# Altium schematic sheet Power.SchDoc: Power Conversions
size 279 x 215 mm; Engineer: Ari Wasch; Organization: UW Robotics; Address1: 200 University Avenue; Address2: Waterloo; Address3: Ontario; Address4: Canada N2L 3G6; DocumentNumber: 1; Revision: 1; SheetNumber: 1; SheetTotal: 3
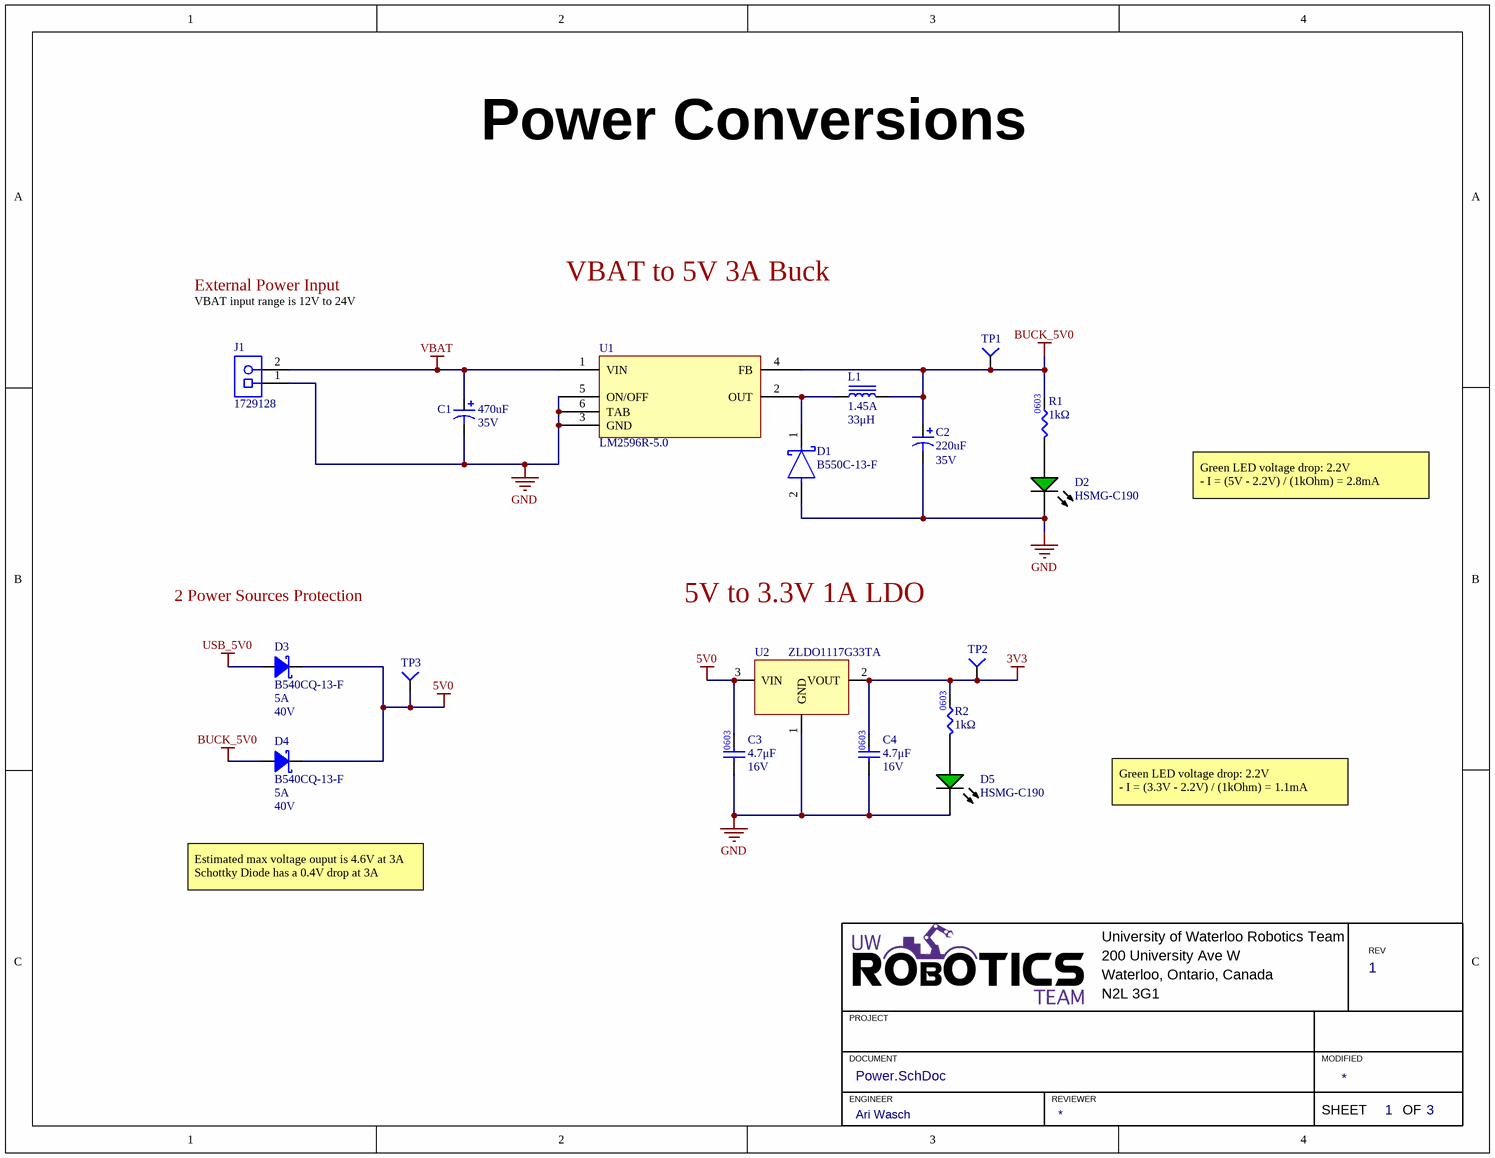
[diagram p0: Power.SchDoc]

## Parts
C1  Voltage: 35V  Capacitance: 470uF  [CAPAE1030X1100N]  (hidden comment: CAP_470uF_35V_ALUM)
C2  220uF  Voltage: 35V  [CAP_8x10.2]
C3  value 4.7μF  Voltage Rating: 16V  [CAP0603]  (hidden comment: CAP_4.7uF_35V_0603)
C4  value 4.7μF  Voltage Rating: 16V  [CAP0603]  (hidden comment: CAP_4.7uF_35V_0603)
D1  B550C-13-F  [FP-SMC-MFG]
D2  HSMG-C190  [AVAG-HSMX-C190_V]
D3  Manufacturer Part Number 1: B540CQ-13-F  Forward Current: 5A  Voltage: 40V  [DO214AB SMC]  (hidden comment: DIO_SCHOTTKY_40V_5A)
D4  Manufacturer Part Number 1: B540CQ-13-F  Forward Current: 5A  Voltage: 40V  [DO214AB SMC]  (hidden comment: DIO_SCHOTTKY_40V_5A)
D5  HSMG-C190  [AVAG-HSMX-C190_V]
J1  1729128  [PHOE-1729128-2_V]
L1  DC Current: 1.45A  Inductance: 33μH  [IND_CKCS6045]  (hidden comment: IND_33uH_1.45A)
R1  value 1kΩ  [RES0603]  (hidden comment: RES_1kΩ_0603_5%)
R2  value 1kΩ  [RES0603]  (hidden comment: RES_1kΩ_0603_5%)
TP1  TESTPOINT_1MM_SQUARE  [TESTPOINT_SQUARE_1MM]  (value not drawn)  (no BOM)
TP2  TESTPOINT_1MM_SQUARE  [TESTPOINT_SQUARE_1MM]  (value not drawn)  (no BOM)
TP3  TESTPOINT_1MM_SQUARE  [TESTPOINT_SQUARE_1MM]  (value not drawn)  (no BOM)
U1  LM2596R-5.0  [LM2596S-5.0]
U2  LDO_3.3V_1A  [ZLDO1117G33TA]  (value not drawn)

## Nets
3V3: C4.2 R2.2 TP2.1(=value) U2.2(VOUT)
5V0: C3.2 D3.2(Cathode) D4.2(Cathode) TP3.1(=value) U2.3(VIN)
BUCK_5V0: C2.1 D4.1(Anode) L1.2 R1.2 TP1.1(=value) U1.4(FB)
GND: C1.2 C2.2 C3.1 C4.1 D1.2(A) D2.2(K) D5.2(K) J1.1 U1.3(GND) U1.5(ON/OFF) U1.6(TAB) U2.1(GND)
USB_5V0: D3.1(Anode)
VBAT: C1.1 J1.2 U1.1(VIN)
NetD1_1: D1.1(C) L1.1 U1.2(OUT)
NetD2_1: D2.1(A) R1.1
NetD5_1: D5.1(A) R2.1

## Notes on the sheet
- External Power Input
- VBAT to 5V 3A Buck
- VBAT input range is 12V to 24V
- Green LED voltage drop: 2.2V
  - I = (5V - 2.2V) / (1kOhm) = 2.8mA
- 2 Power Sources Protection
- 5V to 3.3V 1A LDO
- Green LED voltage drop: 2.2V
  - I = (3.3V - 2.2V) / (1kOhm) = 1.1mA
- Estimated max voltage ouput is 4.6V at 3A
  Schottky Diode has a 0.4V drop at 3A
- University of Waterloo Robotics Team
- 200 University Ave W
- REV
- PROJECT
- Waterloo, Ontario, Canada
- N2L 3G1
- DOCUMENT
- ENGINEER
- REVIEWER
- MODIFIED
- SHEET
- OF

## Library data of the parts
C1 = CAP_470uF_35V_ALUM: CAP ALUM 470uF 20% 35V SMD; Manufacturer 1: ROQANG; Manufacturer Part Number 1: RVT1V471M1010; Datasheet Link: https://datasheet.lcsc.com/szlcsc/2004031004_ROQANG-RVT1V471M1010_C72519.pdf; Height: 11mm; LCSC Number: C72519
C2 = CAP_220uF_35V_ALUM: 220uF 35V Cap; Manufacturer Part Number: VT1V221M0810; Manufacturer 1: KNSCHA; Package: 8x10.2mm; LCSC Number: C310848; Capacitance: 220 uF; Supplier 1: LCSC
C3 C4 = CAP_4.7uF_35V_0603: CAP CER 4.7UF 16V X6S 0603; Manufacturer Part Number 1: CL10A475KO8NNNC; Manufacturer 1: Samsung Electro-Mechanics; Package/Footprint: 0603; Dielectric: X5R; Supplier 1: LCSC; Mounting Type: SMD; LCSC Number: C19666
D1 = CMP-2000-05906-2: DIODE SCHOTTKY 50V 5A SMC; Peak Reverse Current: 500uA; Peak Non-Repetitive Surge Current: 100A; Capacitance: 300pF; Forward Voltage: 700mV; Polarity: Standard; Element Configuration: Single; Length: 7.11mm; Max Operating Temperature: 125°C; Lead Free: Lead Free; Packaging: Tape and Reel; Current Rating: 5A; Output Current: 5A; Termination: SMD/SMT; Mount: Surface Mount; Radiation Hardening: No; Width: 6.22mm; Min Operating Temperature: -55°C; Forward Current: 5A; Voltage Rating (DC): 50V; Case/Package: SMC; Average Rectified Current: 5A; Max Forward Surge Current (Ifsm): 100A; Package Quantity: 3000; REACH SVHC: No SVHC; Max Reverse Voltage (DC): 50V; Number of Pins: 2; Max Repetitive Reverse Voltage (Vrrm): 50V; Height: 2.5mm; Contact Plating: Tin; Weight: 0.007408oz; LCSC Number: C134461
D2 D5 = CMP-1744-00002-1: Chip LED, Green, 2.2 V, -40 to 85 degC, 2-Pin SMD, RoHS, Tape and Reel; Frequency: 400 KHz; Max Supply Voltage: 5.5 V; Access Time: 3500 ns; Clock Frequency: 100 KHz; Case\Package: SOIC; Density: 32 kb; Nominal Supply Current: 2 mA; Interface: Serial; Min Supply Voltage: 1.7 V; Packaging: Tape and Reel; PackageReference: HSMX-C190; ComponentLink2URL: http://docs.avagotech.com/docs/AV02-0551EN; RoHSCompliant: true; Pins: 8; REACH SVHC: No SVHC; Max Operating Temperature: 85 degC; Width: 4 mm; Radiation Hardening: No; Package Quantity: 3000; ComponentLink3Description: Package Specification; ComponentLink1Description: Manufacturer URL; Min Operating Temperature: -40 degC; PackageDescription: 2-Pin Surface Mount Device, Body 1.6 x 0.8 mm, Height 0.9 mm; Max Clock Frequency: 100 KHz; Height: 1.5 mm; ComponentLink1URL: http://www.avagotech.com/; DatasheetVersion: Mar-12; ComponentLink2Description: Datasheet; Mount: Surface Mount; Length: 5 mm; ComponentLink3URL: http://www.fairchildsemi.com/dwg/MA/MA03D.pdf; LCSC Number: C188729
D3 D4 = DIO_SCHOTTKY_40V_5A: DIODE SCHOTTKY 40V 5A SMC; Manufacturer 1: Diodes; Peak Reverse Current: 500uA; Peak Non-Repetitive Surge Current: 100A; Forward Voltage: 550mV; Capacitance: 300pF; Supplier 1: Digi-Key; Mounting Type: SMD; Package/Footprint: SMC; Max Repetitive Reverse Voltage (Vrrm): 40V; Max Forward Surge Current (Ifsm): 100A; Voltage Rating (DC): 40V; Current Rating: 5A; Max Reverse Voltage (DC): 40V; Current: 5A; Supplier Part Number 1: B540C-FDIDKR-ND; LCSC Number: C105556
J1 = CMP-2000-05815-1: PCB Terminal Block, 13.5 A, 400 V, 2-Pin THD, RoHS, Bulk; Manufacturer: Phoenix Contact; Package Version: 03/2015; No. of Rows: 1; Pitch: 5.08mm; No. of Positions: 2; Voltage Rating: 400V; Current Rating: 13500mA; Manufacturer URL: http://www.phoenixcontact.com/; Datasheet URL: https://datasheet.ciiva.com/16046/1729128-16046181.pdf; RoHS: TRUE; Package URL: https://www.phoenixcontact.com/online/portal/pi/pxc/product_detail_page/!ut/p/b1/3VdJjqNKFDxLH8AFycySyWY2ozFsEPOMMQaDOX1XedGL_1Vdm5YXJleknhSKeBkvI6EA8ncAo3AYoDhBQGco6KN7VURTdemj9us_IEKEZo_YHiPAEWEFmDGOHMORkqKYCORBZxgL7ZoaZYcbFFUZ3fqxSY6GOuxydWUuHqz1ynmMFygu583Bob0Ewr6Sd_l-5m-kAueHiB0jpRwZwe58wwtkpxtMYd_LmGcDRU02dRNEyWt6Y2ti5pSyJ_reIkzIulrqApdnbT11V5jnCKbYNCvhEM1MCpPByat_X379-iThf08CI5GfOPqfBeS3BRoBOdD55AKVv0iLwCMq-2BrzXWSGRH7pUGD9uwXQjiph3xL0DKQwdGa0JImiIOmBNOestqgwTHSSs2oOep-78apyXQBvNi8ZLaFjvjWvcaUEBu0MC6Wbe-d6mB0FAebo2lUWinqYaZs5DAYzV0RP9yitUjnGJ0iI9xhZkT42OCQNUJJhkgWINNQLP2JFP6OpMg3JCVg70jqHT0lvKOnhHf0lPuOnnLf0VPuWx6_dxwUIvwk5WMkT0kLL1mh61l2yZVSzG3pYV_bqo-mj6uMKwKwdnnW8Jh5RTOJzMOA5c-eJDaZQw4mTMPH02PvS_ZAqNVjVTo2WyYLkwH_KU1mmmG5kjRhDqPXLwwVHvVOjCM60-fpXvTDfMGW1PVFVS1r4e4yVDk4ZdNbkUHvqPqQSeian4UD39fNKmachqdJ1NJbyk8rXT9mXTvPk3oE5meulKGgiruPJek-4I9hTT6G8ZLOyRSm2RRVbThERQad5OS28hdt4YW4vG0stgYYzsWsK4_7y6DZMjJSCqri1kyiZR5vD7pwIrNR7QwPHTcLTI5qT7eRlpHrdGiupYlqQDJ7zy_CND8fWWBoLRXxk1RVcXiBQwbTD4Xi7KL-FuO94t9xaqweXzH; PartNumber: 1729128; Package Description: 2-Pin Through Hole Device, Body 8.1 x 10.16 mm, Pitch 5.08 mm; Datasheet Version: 12/2013; Mounting Technology: ThroughHole; Orientation: Horizontal; Package Reference: 1729128-2; Packing: Bulk; LCSC Number: C91153
L1 = IND_33uH_1.45A: INDUCTOR 33UH 1.45A SMD ROHS; Manufacturer 1: CENKER; Manufacturer Part Number 1: CKCS6045-33uH; DC Resistance (DCR): 137mΩ; RMS Current (Irms): 1.45A; LCSC Number: C354635
R1 R2 = RES_1kΩ_0603_5%: RES 1K OHM 5% 1/10W 0603; Manufacturer 1: Yageo; Manufacturer Part Number 1: RC0603JR-071KL; Package/Footprint: 0603; Supplier Part Number 1: 311-1.0KGRCT-ND; Supplier 1: Digi-Key; Mounting Type: SMD; LCSC Number: C14676
TP1-TP3 = TESTPOINT_1MM_SQUARE: TESTPOINT 1MM SQUARE
U1 = LM2596R-5.0: IC REG BUCK 5V 3A TO220-5; Manufacturer 1: HTC Korea TAEJIN Tech; Min Voltage Input: 4.5V; Max Voltage Input: 40V; Voltage Output: 5V; Current Output: 3A; Manufacturer Part Number 1: LM2596R-5.0; Supplier 1: LCSC; LCSC Number: C77782; Datasheet: https://lcsc.com/search?q=WJ127-5.0-3P
U2 = LDO_3.3V_1A: IC REG LINEAR 3.3V 1A SOT223; Manufacturer 1: Diodes Incorperated; Input Voltage (Max): 18V; Voltage Dropout (Max): 1.3V@1A; Package/Footprint: SOT-224; Supplier 1: Digi-Key; Supplier Part Number 1: ZLDO1117G33TA; Manufacturer Part Number 1: ZLDO1117G33TA; Output Voltage (Fixed): 3.3V; Output Current: 1A; Operating Temperature: -40°C - 125°C; Mounting Type: Surface Mount; LCSC Number: C444421